# Altium project CheetahStack.PrjPcb
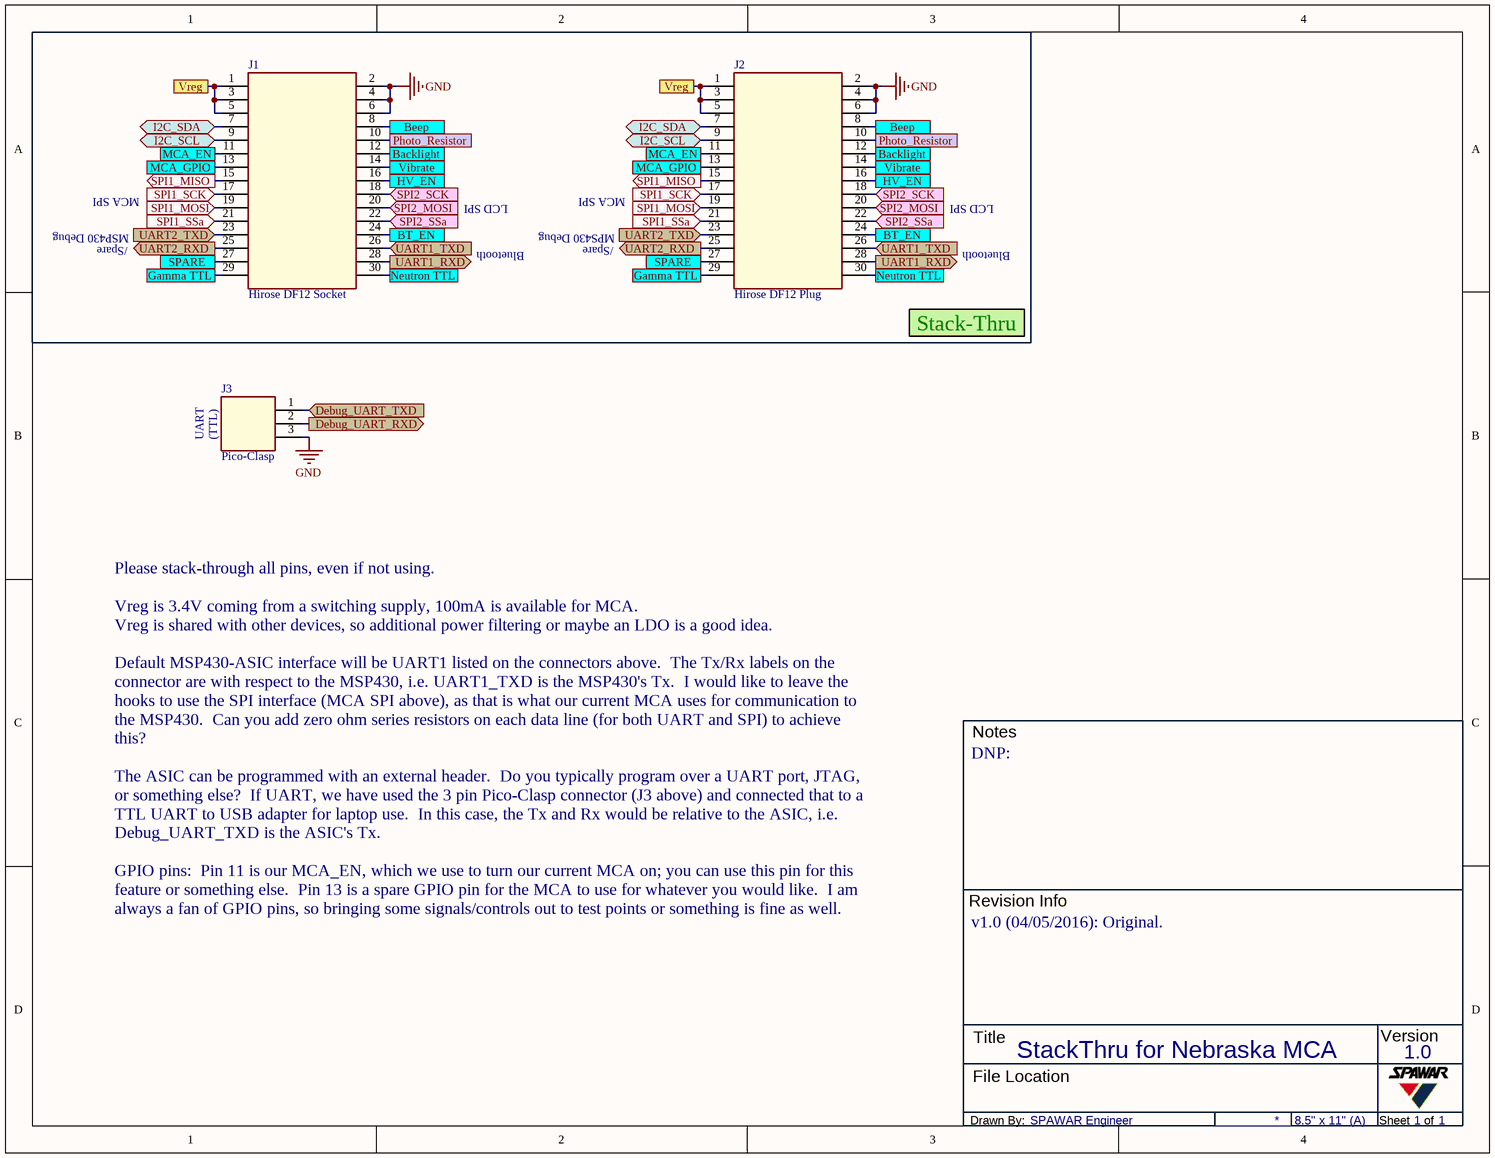
[diagram p0: CheetahStack.SchDoc]
3 sheets, 85 parts. Net scope: flat (ports and power ports of the same name join across sheets).
Board file: CheetahStack.PcbDoc
Sheets:
  CheetahStack.SchDoc
  Asic.SchDoc
  Power.SchDoc

## Sheet CheetahStack.SchDoc: Title
size Letter; Engineer: David Simmons; Organization: SPAWAR Systems Center Pacific; Address1: 3 Minna Close; Address2: Belrose; Address3: NSW 2085; Address4: Australia; Revision: 1; SheetNumber: 1; SheetTotal: 1; PageSetup: Record=PageOptions|CenterHorizontal=True|CenterVertical=True|PrintScale=0.94|XCorrection=1.00|YCorrection=1.00|PrintKind=0|BorderSize=5000000|LeftOffset=0|BottomOffset=0|Orientation=2|PaperLength=1000|PaperWidth=1000|Scale=100|PaperSource=15|PrintQuality=-3|MediaType=1|DitherType=10|PrintScaleMode=1|PaperKind=A3|PaperIndex=8

### Parts
J1  Hirose DF12 Socket  [DF12B-30DS-0.5V(86)]
J2  Hirose DF12 Plug  [DF12B(5.0)-30DP-0.5V(86)]
J3  Pico-Clasp  [Molex 1x3 Pin, Pico-Clasp]

### Ports
Backlight, Beep, BT_EN, Debug_UART_RXD, Debug_UART_TXD, Gamma TTL, HV_EN, I2C_SCL, I2C_SDA, MCA_EN, MCA_GPIO, Neutron TTL, Photo_Resistor, SPARE, SPI1_MISO, SPI1_MOSI, SPI1_SCK, SPI1_SSa, SPI2_MOSI, SPI2_SCK, SPI2_SSa, UART1_RXD, UART1_TXD, UART2_RXD, UART2_TXD, Vibrate, Vreg

### Nets
GND: J1.2 J1.4 J1.6 J2.2 J2.4 J2.6 J3.3
Backlight: J1.12 J2.12 ; port Backlight
Beep: J1.8 J2.8 ; port Beep
BT_EN: J1.24 J2.24 ; port BT_EN
Debug_UART_RXD: J3.2 ; port Debug_UART_RXD
Debug_UART_TXD: J3.1 ; port Debug_UART_TXD
Gamma TTL: J1.29 J2.29 ; port Gamma TTL
HV_EN: J1.16 J2.16 ; port HV_EN
I2C_SCL: J1.9 J2.9 ; port I2C_SCL
I2C_SDA: J1.7 J2.7 ; port I2C_SDA
MCA_EN: J1.11 J2.11 ; port MCA_EN
MCA_GPIO: J1.13 J2.13 ; port MCA_GPIO
Neutron TTL: J1.30 J2.30 ; port Neutron TTL
Photo_Resistor: J1.10 J2.10 ; port Photo_Resistor
SPARE: J1.27 J2.27 ; port SPARE
SPI1_MISO: J1.15 J2.15 ; port SPI1_MISO
SPI1_MOSI: J1.19 J2.19 ; port SPI1_MOSI
SPI1_SCK: J1.17 J2.17 ; port SPI1_SCK
SPI1_SSa: J1.21 J2.21 ; port SPI1_SSa
SPI2_MOSI: J1.20 J2.20 ; port SPI2_MOSI
SPI2_SCK: J1.18 J2.18 ; port SPI2_SCK
SPI2_SSa: J1.22 J2.22 ; port SPI2_SSa
UART1_RXD: J1.28 J2.28 ; port UART1_RXD
UART1_TXD: J1.26 J2.26 ; port UART1_TXD
UART2_RXD: J1.25 J2.25 ; port UART2_RXD
UART2_TXD: J1.23 J2.23 ; port UART2_TXD
Vibrate: J1.14 J2.14 ; port Vibrate
Vreg: J1.1 J1.3 J1.5 J2.1 J2.3 J2.5 ; port Vreg

### Notes on the sheet
- MSP430 Debug
- MCA SPI
- LCD SPI
- MPS430 Debug
- /Spare
- Bluetooth
- Stack-Thru
- UART
- (TTL)
- Notes
- DNP:
- Revision Info
- Please stack-through all pins, even if not using.
  Vreg is 3.4V coming from a switching supply, 100mA is available for MCA.
  Vreg is shared with other devices, so additional power filtering or maybe an LDO is a good idea.
  Default MSP430-ASIC interface will be UART1 listed on the connectors above.  The Tx/Rx labels on the connector are with respect to the MSP430, i.e. UART1_TXD is the MSP430's Tx.  I would like to leave the hooks to use the SPI interface (MCA SPI above), as that is what our current MCA uses for communication to the MSP430.  Can you add zero ohm series resistors on each data line (for both UART and SPI) to achieve this?
  The ASIC can be programmed with an external header.  Do you typically program over a UART port, JTAG, or something else?  If UART, we have used the 3 pin Pico-Clasp connector (J3 above) and connected that to a TTL UART to USB adapter for laptop use.  In this case, the Tx and Rx would be relative to the ASIC, i.e. Debug_UART_TXD is the ASIC's Tx.
  GPIO pins:  Pin 11 is our MCA_EN, which we use to turn our current MCA on; you can use this pin for this feature or something else.  Pin 13 is a spare GPIO pin for the MCA to use for whatever you would like.  I am always a fan of GPIO pins, so bringing some signals/controls out to test points or something is fine as well.
- v1.0 (04/05/2016): Original.
- Title
- StackThru for Nebraska MCA
- 1.0
- Version
- Drawn By:
- SPAWAR Engineer
- File Location
- 8.5" x 11" (A)
- Sheet
- 1
- of

### Library data of the parts
J1 = Conn, Hirose, 2x15 Pin, DF12, Socket, Vert, SMT, with metal fitting: Dist Part: 798-DF12B30DS05V86; Cost ($): 1.24; Manufacturer: Hirose; Manf Part: DF12B-30DS-0.5V(86); Distributor: Mouser
J2 = Conn, Hirose, 2x15 Pin, DF12, Plug, Vert, SMT, 5.0mm, with metal fitting: Dist Part: 798-DF12B5030DP05V86; Cost ($): 1.49; Manufacturer: Hirose; Manf Part: DF12B(5.0)-30DP-0.5V(86); Distributor: Mouser
J3 = Conn, Molex, 1x3 Pin, Pico-Clasp, Horz: Dist Part: WM7894CT-ND; Manf Part: 501568-0307; Cost ($): 0.73; Manufacturer: Molex; Distributor: Digi-Key

## Sheet Asic.SchDoc: Title
size Letter; Engineer: David Simmons; Organization: SPAWAR Systems Center Pacific; Address1: 3 Minna Close; Address2: Belrose; Address3: NSW 2085; Address4: Australia; Revision: 1; SheetNumber: 1; SheetTotal: 1; PageSetup: Record=PageOptions|CenterHorizontal=True|CenterVertical=True|PrintScale=0.94|XCorrection=1.00|YCorrection=1.00|PrintKind=0|BorderSize=5000000|LeftOffset=0|BottomOffset=0|Orientation=2|PaperLength=1000|PaperWidth=1000|Scale=100|PaperSource=15|PrintQuality=600|MediaType=1|DitherType=10|PaperKind=Letter (8.5" x 11")|PrintScaleMode=1
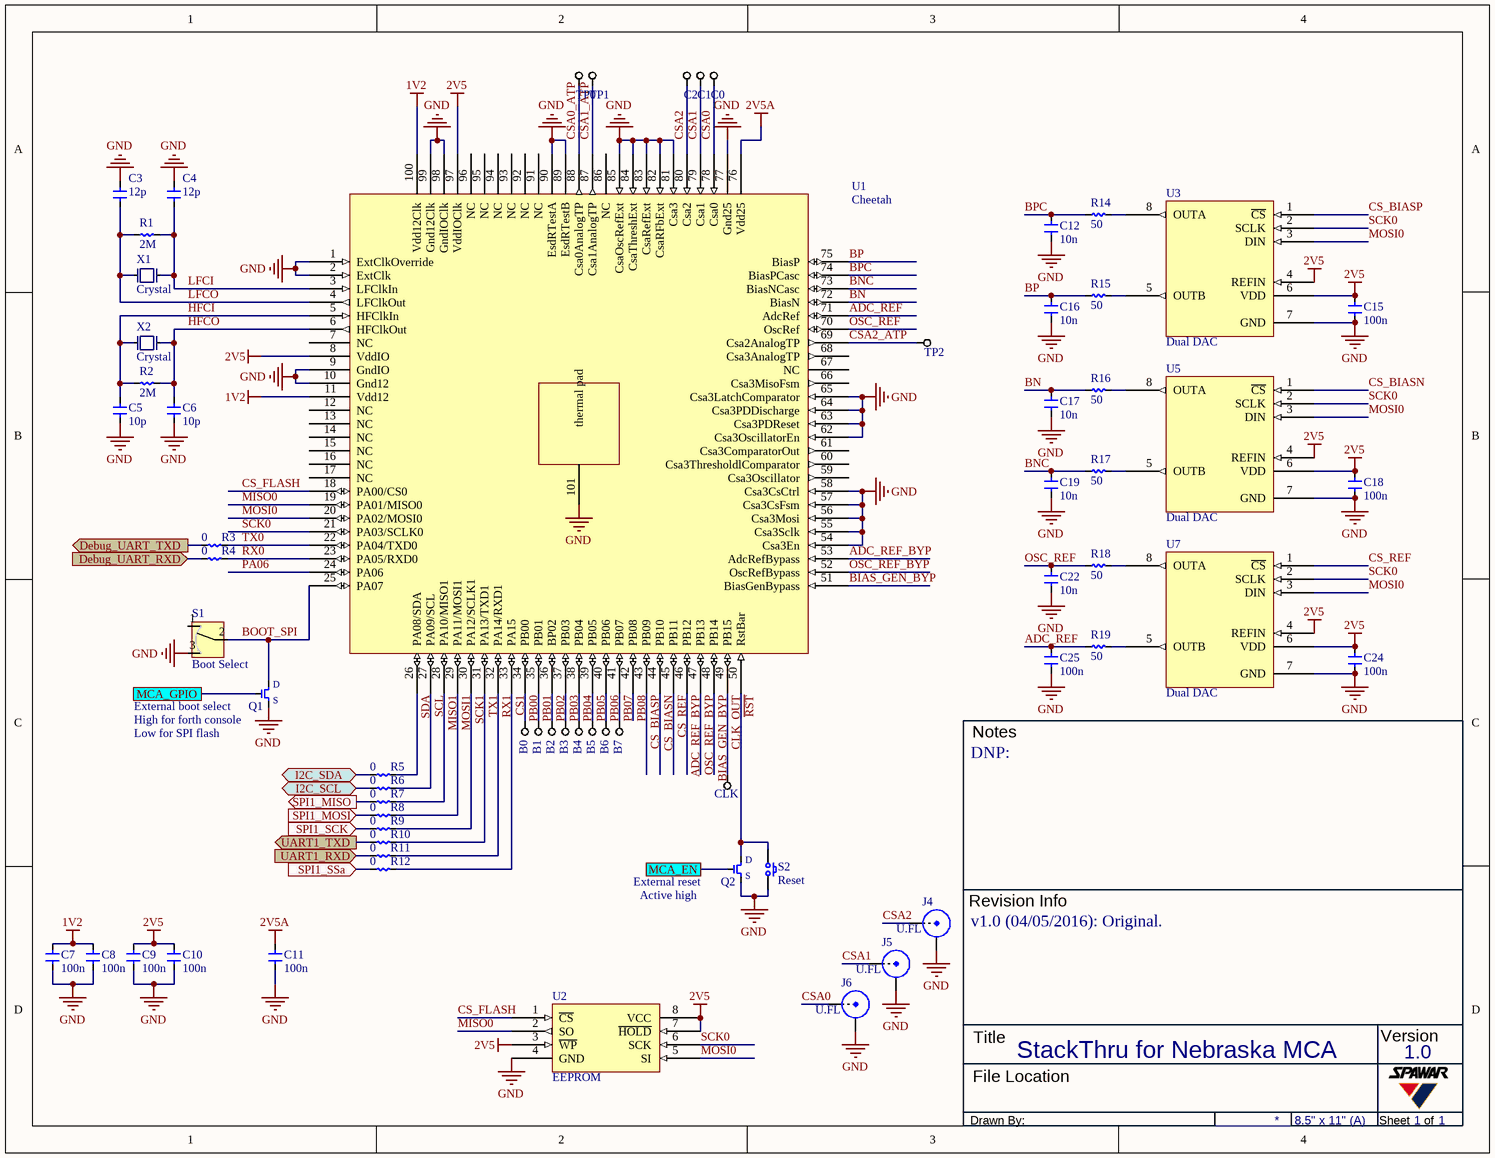
[diagram p1: Asic.SchDoc]

### Parts
B0  Test Point  [TESTPOINT-PTH-100mil]  (value not drawn)
B1  Test Point  [TESTPOINT-PTH-100mil]  (value not drawn)
B2  Test Point  [TESTPOINT-PTH-100mil]  (value not drawn)
B3  Test Point  [TESTPOINT-PTH-100mil]  (value not drawn)
B4  Test Point  [TESTPOINT-PTH-100mil]  (value not drawn)
B5  Test Point  [TESTPOINT-PTH-100mil]  (value not drawn)
B6  Test Point  [TESTPOINT-PTH-100mil]  (value not drawn)
B7  Test Point  [TESTPOINT-PTH-100mil]  (value not drawn)
C0  Test Point  [TESTPOINT-PTH-100mil]  (value not drawn)
C1  Test Point  [TESTPOINT-PTH-100mil]  (value not drawn)
C2  Test Point  [TESTPOINT-PTH-100mil]  (value not drawn)
C3  value 12p  [CAPC1005X05N]  (hidden comment: CAP-IPC7351B)
C4  value 12p  [CAPC1005X05N]  (hidden comment: CAP-IPC7351B)
C5  value 10p  [CAPC1005X05N]  (hidden comment: CAP-IPC7351B)
C6  value 10p  [CAPC1005X05N]  (hidden comment: CAP-IPC7351B)
C7  value 100n  [CAPC1005X05N]  (hidden comment: CAP-IPC7351B)
C8  value 100n  [CAPC1005X05N]  (hidden comment: CAP-IPC7351B)
C9  value 100n  [CAPC1005X05N]  (hidden comment: CAP-IPC7351B)
C10  value 100n  [CAPC1005X05N]  (hidden comment: CAP-IPC7351B)
C11  value 100n  [CAPC1005X05N]  (hidden comment: CAP-IPC7351B)
C12  value 10n  [CAPC1005X05N]  (hidden comment: CAP-IPC7351B)
C15  100n  [CAPC1005X05N]
C16  value 10n  [CAPC1005X05N]  (hidden comment: CAP-IPC7351B)
C17  value 10n  [CAPC1005X05N]  (hidden comment: CAP-IPC7351B)
C18  100n  [CAPC1005X05N]
C19  value 10n  [CAPC1005X05N]  (hidden comment: CAP-IPC7351B)
C22  value 10n  [CAPC1005X05N]  (hidden comment: CAP-IPC7351B)
C24  100n  [CAPC1005X05N]
C25  value 100n  [CAPC1005X05N]  (hidden comment: CAP-IPC7351B)
CLK  Test Point  [TESTPOINT-1MM]  (value not drawn)
J4  U.FL  [U.FL]
J5  U.FL  [U.FL]
J6  U.FL  [U.FL]
Q1  NFET-SOT723  [SOT-723]  (value not drawn)
Q2  NFET-SOT723  [SOT-723]  (value not drawn)
R1  value 2M  [RESC1005X04N]  (hidden comment: RES-IPC7351B)
R2  value 2M  [RESC1005X04N]  (hidden comment: RES-IPC7351B)
R3  value 0  [RESC1005X04N]  (hidden comment: RES-IPC7351B)
R4  value 0  [RESC1005X04N]  (hidden comment: RES-IPC7351B)
R5  value 0  [RESC1005X04N]  (hidden comment: RES-IPC7351B)
R6  value 0  [RESC1005X04N]  (hidden comment: RES-IPC7351B)
R7  value 0  [RESC1005X04N]  (hidden comment: RES-IPC7351B)
R8  value 0  [RESC1005X04N]  (hidden comment: RES-IPC7351B)
R9  value 0  [RESC1005X04N]  (hidden comment: RES-IPC7351B)
R10  value 0  [RESC1005X04N]  (hidden comment: RES-IPC7351B)
R11  value 0  [RESC1005X04N]  (hidden comment: RES-IPC7351B)
R12  value 0  [RESC1005X04N]  (hidden comment: RES-IPC7351B)
R14  value 50  [RESC1005X04N]  (hidden comment: RES-IPC7351B)
R15  value 50  [RESC1005X04N]  (hidden comment: RES-IPC7351B)
R16  value 50  [RESC1005X04N]  (hidden comment: RES-IPC7351B)
R17  value 50  [RESC1005X04N]  (hidden comment: RES-IPC7351B)
R18  value 50  [RESC1005X04N]  (hidden comment: RES-IPC7351B)
R19  value 50  [RESC1005X04N]  (hidden comment: RES-IPC7351B)
S1  Boot Select  [CKC-PCM12SMTR]
S2  Reset  [ESWITCH-TL3330AF]
TP0  Test Point  [TESTPOINT-PTH-100mil]  (value not drawn)
TP1  Test Point  [TESTPOINT-PTH-100mil]  (value not drawn)
TP2  Test Point  [TESTPOINT-PTH-100mil]  (value not drawn)
U1  Cheetah  [QFN40P1200X1200X80_HS-101M]
U2  EEPROM  [DFN50P200X300X60-8N]
U3  Dual DAC  [TSOP65P490X110-8N]
U5  Dual DAC  [TSOP65P490X110-8N]
U7  Dual DAC  [TSOP65P490X110-8N]
X1  Crystal  [ABRACON-ABS06]
X2  Crystal  [ABRACON-ABM11]

### Ports
Debug_UART_RXD, Debug_UART_TXD, I2C_SCL, I2C_SDA, MCA_EN, MCA_GPIO, SPI1_MISO, SPI1_MOSI, SPI1_SCK, SPI1_SSa, UART1_RXD, UART1_TXD

### Nets
1V2: C7.2 C8.2 U1.11(Vdd12) U1.100(Vdd12Clk)
2V5: C9.2 C10.2 C15.2 C18.2 C24.2 U1.8(VddIO) U1.97(VddIOClk) U2.3(~{WP}) U2.7(~{HOLD}) U2.8(VCC) U3.4(REFIN) U3.6(VDD) U5.4(REFIN) U5.6(VDD) U7.4(REFIN) U7.6(VDD)
2V5A: C11.2 U1.76(Vdd25)
GND: C3.2 C4.2 C5.2 C6.2 C7.1 C8.1 C9.1 C10.1 C11.1 C12.1 C15.1 C16.1 C17.1 C18.1 C19.1 C22.1 C24.1 C25.1 J4.GND J5.GND J6.GND Q1.3(S) Q2.3(S) S1.3 S2.2 U1.1(ExtClkOverride) U1.2(ExtClk) U1.9(GndIO) U1.10(Gnd12) U1.54(Csa3En) U1.55(Csa3Sclk) U1.56(Csa3Mosi) U1.57(Csa3CsFsm) U1.58(Csa3CsCtrl) U1.62(Csa3OscillatorEn) U1.63(Csa3PDReset) U1.64(Csa3PDDischarge) U1.65(Csa3LatchComparator) U1.77(Gnd25) U1.81(Csa3) U1.82(CsaRFbExt) U1.83(CsaRefExt) U1.84(CsaThreshExt) U1.85(CsaOscRefExt) U1.89(EsdRTestB) U1.90(EsdRTestA) U1.98(GndIOClk) U1.99(Gnd12Clk) U1.101(thermal_pad) U2.4(GND) U3.7(GND) U5.7(GND) U7.7(GND) X2.2 X2.4
ADC_REF: C25.2 R19.2 U1.71(AdcRef)
ADC_REF_BYP: U1.46(PB12) U1.53(AdcRefBypass)
BIAS_GEN_BYP: U1.48(PB14) U1.51(BiasGenBypass)
BN: C17.2 R16.2 U1.72(BiasN)
BNC: C19.2 R17.2 U1.73(BiasNCasc)
BOOT_SPI: Q1.2(D) S1.2 U1.25(PA07)
BP: C16.2 R15.2 U1.75(BiasP)
BPC: C12.2 R14.2 U1.74(BiasPCasc)
CLK_OUT: CLK.1(TP) U1.49(PB15)
CS1: R12.2 U1.33(PA15)
CS_BIASN: U1.44(PB10) U5.1(~{CS})
CS_BIASP: U1.43(PB09) U3.1(~{CS})
CS_FLASH: U1.18(PA00/CS0) U2.1(~{CS})
CS_REF: U1.45(PB11) U7.1(~{CS})
CSA0: C0.1(TP) J6.SIG U1.78(Csa0)
CSA0_ATP: TP0.1(TP) U1.88(Csa0AnalogTP)
CSA1: C1.1(TP) J5.SIG U1.79(Csa1)
CSA1_ATP: TP1.1(TP) U1.87(Csa1AnalogTP)
CSA2: C2.1(TP) J4.SIG U1.80(Csa2)
CSA2_ATP: TP2.1(TP) U1.69(Csa2AnalogTP)
Debug_UART_RXD: R4.1 ; port Debug_UART_RXD
Debug_UART_TXD: R3.1 ; port Debug_UART_TXD
HFCI: C5.1 R2.1 U1.5(HFClkIn) X2.1
HFCO: C6.1 R2.2 U1.6(HFClkOut) X2.3
I2C_SCL: R6.1 ; port I2C_SCL
I2C_SDA: R5.1 ; port I2C_SDA
LFCI: C4.1 R1.2 U1.3(LFClkIn) X1.1
LFCO: C3.1 R1.1 U1.4(LFClkOut) X1.2
MCA_EN: Q2.1(G) ; port MCA_EN
MCA_GPIO: Q1.1(G) ; port MCA_GPIO
MISO0: U1.19(PA01/MISO0) U2.2(SO)
MISO1: R7.2 U1.28(PA10/MISO1)
MOSI0: U1.20(PA02/MOSI0) U2.5(SI) U3.3(DIN) U5.3(DIN) U7.3(DIN)
MOSI1: R8.2 U1.29(PA11/MOSI1)
OSC_REF: C22.2 R18.2 U1.70(OscRef)
OSC_REF_BYP: U1.47(PB13) U1.52(OscRefBypass)
PA06: U1.24(PA06)
PB00: B0.1(TP) U1.34(PB00)
PB01: B1.1(TP) U1.35(PB01)
PB02: B2.1(TP) U1.36(BP02)
PB03: B3.1(TP) U1.37(PB03)
PB04: B4.1(TP) U1.38(PB04)
PB05: B5.1(TP) U1.39(PB05)
PB06: B6.1(TP) U1.40(PB06)
PB07: B7.1(TP) U1.41(PB07)
PB08: U1.42(PB08)
~{RST}: Q2.2(D) S2.1 U1.50(RstBar)
RX0: R4.2 U1.23(PA05/RXD0)
RX1: R11.2 U1.32(PA14/RXD1)
SCK0: U1.21(PA03/SCLK0) U2.6(SCK) U3.2(SCLK) U5.2(SCLK) U7.2(SCLK)
SCK1: R9.2 U1.30(PA12/SCLK1)
SCL: R6.2 U1.27(PA09/SCL)
SDA: R5.2 U1.26(PA08/SDA)
SPI1_MISO: R7.1 ; port SPI1_MISO
SPI1_MOSI: R8.1 ; port SPI1_MOSI
SPI1_SCK: R9.1 ; port SPI1_SCK
SPI1_SSa: R12.1 ; port SPI1_SSa
TX0: R3.2 U1.22(PA04/TXD0)
TX1: R10.2 U1.31(PA13/TXD1)
UART1_RXD: R11.1 ; port UART1_RXD
UART1_TXD: R10.1 ; port UART1_TXD
NetR14_1: R14.1 U3.8(OUTA)
NetR15_1: R15.1 U3.5(OUTB)
NetR16_1: R16.1 U5.8(OUTA)
NetR17_1: R17.1 U5.5(OUTB)
NetR18_1: R18.1 U7.8(OUTA)
NetR19_1: R19.1 U7.5(OUTB)

Not connected (* = marked no-connect by the designer): S1 1; U1 7(NC) 12(NC) 13(NC) 14(NC) 15(NC) 16(NC) 17(NC) 59(Csa3Oscillator) 60(Csa3ThresholdlComparator) 61(Csa3ComparatorOut) 66(Csa3MisoFsm) 67(NC) 68(Csa3AnalogTP) 86(NC) 91(NC) 92(NC) 93(NC) 94(NC) 95(NC) 96(NC)

### Notes on the sheet
- (near Q1) External boot select
- (near Q1) High for forth console
- (near Q1) Low for SPI flash
- Notes
- (near Q2) External reset
- (near Q2) Active high
- DNP:
- (near J4) Revision Info
- (near J4) v1.0 (04/05/2016): Original.
- Title
- StackThru for Nebraska MCA
- 1.0
- Version
- Drawn By:
- File Location
- 8.5" x 11" (A)
- Sheet
- 1
- of

### Library data of the parts
B0-B7 C0-C2 CLK TP0-TP2 = TESTPOINT: Probe Test Point
C3-C12 C15-C19 C22 C24 C25 = CAP-IPC7351B: SMD Capacitor Following IPC-7351B Based on TDK's Product Line
  C15 C18 C24: Value: 100n
J4-J6 = RF-UFL: U.FL RF Connector
Q1 Q2 = NFET-SOT723: Generic NFET; Value: 1G
R1-R12 R14-R19 = RES-IPC7351B: SMD Resistor Following IPC-7351B Based on Panasonics's Product Line
S1 = CKC-PCM12SMTR: C&K Components SPDT Switch, Right Angle
S2 = ESWITCH-TL3330AF: E-Switch TL3330AF Series
U1 = MOSIS-CHEETAH: Ultra Low Power Charge Sensitive Radiation Front End
U2 = ADESTO-AT25XE: Adesto SPI Serial Flash Memory with Dual-I/O Support
U3 U5 U7 = MAX-5532: Maxim Dual, Ultra-Low-Power,  12-Bit, Voltage-Output DACs
X1 = ABRACON-ABS06: 32.768 kHz SMD low profile crystal
X2 = ABRACON-ABM11: Ceramics SMD Ultra Miniature Quartz Crystal

## Sheet Power.SchDoc: Title
size Letter; Engineer: David Simmons; Organization: SPAWAR Systems Center Pacific; Address1: 3 Minna Close; Address2: Belrose; Address3: NSW 2085; Address4: Australia; Revision: 1; SheetNumber: 1; SheetTotal: 1; PageSetup: Record=PageOptions|CenterHorizontal=True|CenterVertical=True|PrintScale=0.94|XCorrection=1.00|YCorrection=1.00|PrintKind=0|BorderSize=5000000|LeftOffset=0|BottomOffset=0|Orientation=2|PaperLength=1000|PaperWidth=1000|Scale=100|PaperSource=15|PrintQuality=600|MediaType=1|DitherType=10|PaperKind=Letter (8.5" x 11")|PrintScaleMode=1
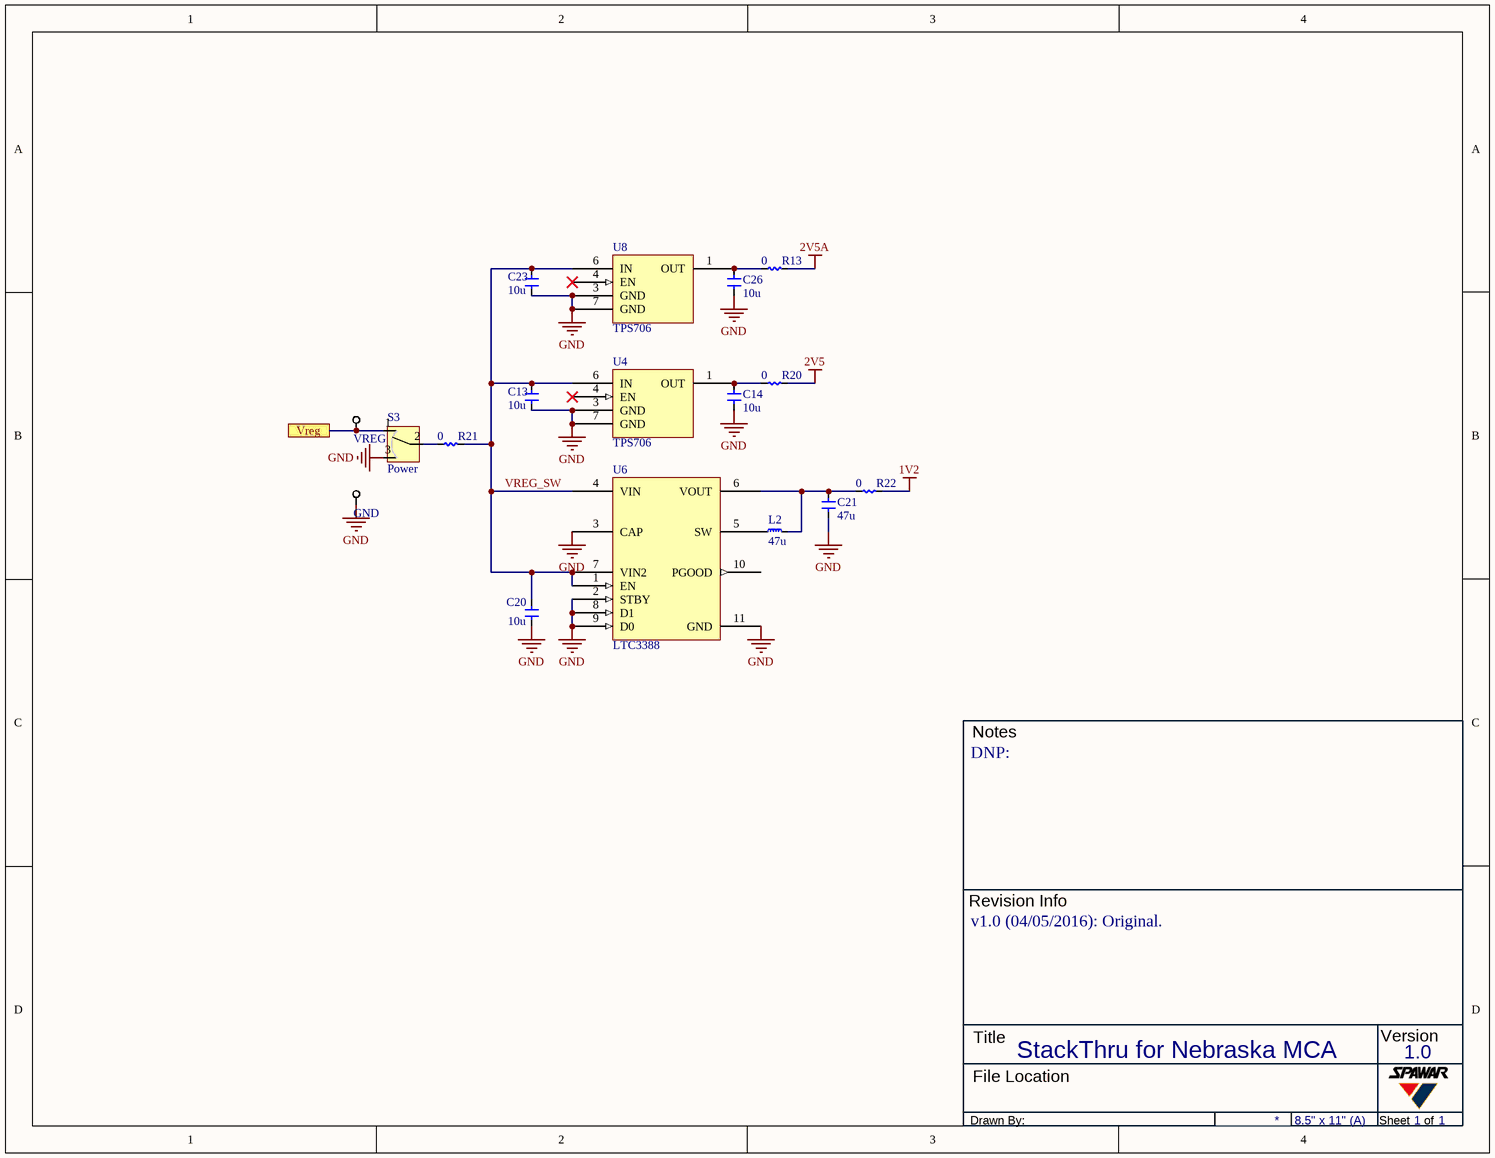
[diagram p2: Power.SchDoc]

### Parts
C13  value 10u  [CAPC1005X05N]  (hidden comment: CAP-IPC7351B)
C14  value 10u  [CAPC1005X05N]  (hidden comment: CAP-IPC7351B)
C20  value 10u  [CAPC1005X05N]  (hidden comment: CAP-IPC7351B)
C21  value 47u  [CAPC2012X12N]  (hidden comment: CAP-IPC7351B)
C23  value 10u  [CAPC1005X05N]  (hidden comment: CAP-IPC7351B)
C26  value 10u  [CAPC1005X05N]  (hidden comment: CAP-IPC7351B)
GND  Test Point  [TESTPOINT-0603]  (value not drawn)
L2  value 47u  [INDC3030X15N]  (hidden comment: MURATA-LQH3NP_M0)
R13  value 0  [RESC1005X04N]  (hidden comment: RES-IPC7351B)
R20  value 0  [RESC1005X04N]  (hidden comment: RES-IPC7351B)
R21  value 0  [RESC1005X04N]  (hidden comment: RES-IPC7351B)
R22  value 0  [RESC1005X04N]  (hidden comment: RES-IPC7351B)
S3  Power  [CKC-PCM12SMTR]
U4  TPS706  [DFN65P200X200X80_HS-7N]
U6  LTC3388  [DFN50P300X300X80_HS-11M]
U8  TPS706  [DFN65P200X200X80_HS-7N]
VREG  Test Point  [TESTPOINT-0603]  (value not drawn)

### Ports
Vreg

### Nets
1V2: R22.2
2V5: R20.2
2V5A: R13.2
GND: C13.1 C14.1 C20.1 C21.1 C23.1 C26.1 GND.1(TP) S3.3 U4.3(GND) U4.7(GND) U6.2(STBY) U6.3(CAP) U6.8(D1) U6.9(D0) U6.11(GND) U8.3(GND) U8.7(GND)
Vreg: S3.1 VREG.1(TP) ; port Vreg
VREG_SW: C13.2 C20.2 C23.2 R21.2 U4.6(IN) U6.1(EN) U6.4(VIN) U6.7(VIN2) U8.6(IN)
NetC14_2: C14.2 R20.1 U4.1(OUT)
NetC21_2: C21.2 L2.2 R22.1 U6.6(VOUT)
NetC26_2: C26.2 R13.1 U8.1(OUT)
NetL2_1: L2.1 U6.5(SW)
NetR21_1: R21.1 S3.2

Not connected (* = marked no-connect by the designer): U4 2(NC) 4(EN)* 5(NC); U6 10(PGOOD); U8 2(NC) 4(EN)* 5(NC)

### Notes on the sheet
- Notes
- DNP:
- Revision Info
- v1.0 (04/05/2016): Original.
- Title
- StackThru for Nebraska MCA
- 1.0
- Version
- Drawn By:
- File Location
- 8.5" x 11" (A)
- Sheet
- 1
- of

### Library data of the parts
C13 C14 C20 C21 C23 C26 = CAP-IPC7351B: as C3 on sheet Asic
GND VREG = TESTPOINT: Probe Test Point
L2 = MURATA-LQH3NP_M0: MURATA - Chip Inductor (Chip Coil) Power Inductor (Wire Wound Type)
R13 R20-R22 = RES-IPC7351B: as R1 on sheet Asic
S3 = CKC-PCM12SMTR: C&K Components SPDT Switch, Right Angle
U4 U8 = TI-TPS706: LDO
U6 = LT-LTC3388: Linear Technology 20V High Efficiency  Nanopower Step-Down Regulator

## Nets that join several sheets
1V2: Asic (C7.2 C8.2 U1.11 U1.100), Power (R22.2)
2V5: Asic (16 pins), Power (R20.2)
2V5A: Asic (C11.2 U1.76), Power (R13.2)
GND: CheetahStack (7 pins), Asic (55 pins), Power (17 pins)
Debug_UART_RXD: CheetahStack (J3.2), Asic (R4.1)
Debug_UART_TXD: CheetahStack (J3.1), Asic (R3.1)
I2C_SCL: CheetahStack (J1.9 J2.9), Asic (R6.1)
I2C_SDA: CheetahStack (J1.7 J2.7), Asic (R5.1)
MCA_EN: CheetahStack (J1.11 J2.11), Asic (Q2.1)
MCA_GPIO: CheetahStack (J1.13 J2.13), Asic (Q1.1)
SPI1_MISO: CheetahStack (J1.15 J2.15), Asic (R7.1)
SPI1_MOSI: CheetahStack (J1.19 J2.19), Asic (R8.1)
SPI1_SCK: CheetahStack (J1.17 J2.17), Asic (R9.1)
SPI1_SSa: CheetahStack (J1.21 J2.21), Asic (R12.1)
UART1_RXD: CheetahStack (J1.28 J2.28), Asic (R11.1)
UART1_TXD: CheetahStack (J1.26 J2.26), Asic (R10.1)
Vreg: CheetahStack (6 pins), Power (S3.1 VREG.1)